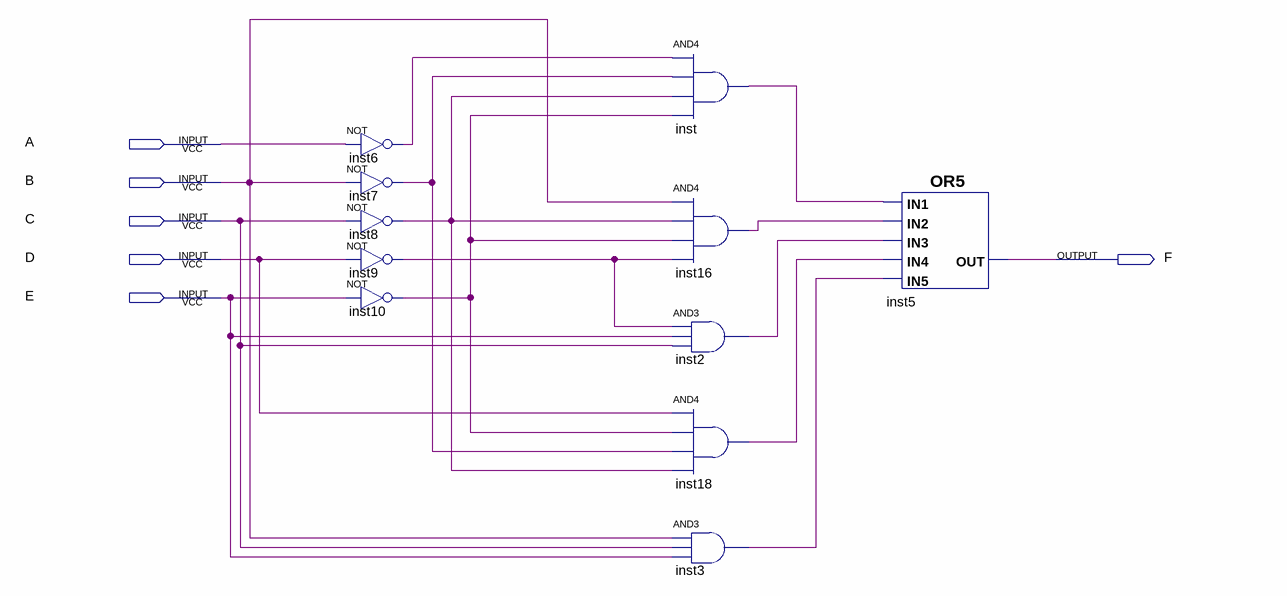
[diagram p0: schematic sheet]
// Quartus schematic Lab01.bdf as structural Verilog: 11 symbols, 6 pins
module Lab01 (
  input  A,
  input  B,
  input  C,
  input  D,
  input  E,
  output F
);

  wire inst2_out, inst3_out, inst6_out, inst7_out, inst8_out, inst9_out, inst10_out, inst16_out, inst18_out,
       inst_out;

  not inst6 (inst6_out, A);
  not inst7 (inst7_out, B);
  not inst8 (inst8_out, C);
  not inst9 (inst9_out, D);
  not inst10 (inst10_out, E);
  and inst (inst_out, inst6_out, inst7_out, inst8_out, inst10_out);
  and inst16 (inst16_out, B, inst8_out, inst10_out, inst9_out);
  and inst2 (inst2_out, inst9_out, E, C);
  and inst18 (inst18_out, D, inst10_out, inst7_out, inst8_out);
  and inst3 (inst3_out, B, C, E);
  or inst5 (F, inst_out, inst16_out, inst2_out, inst18_out, inst3_out);
endmodule
